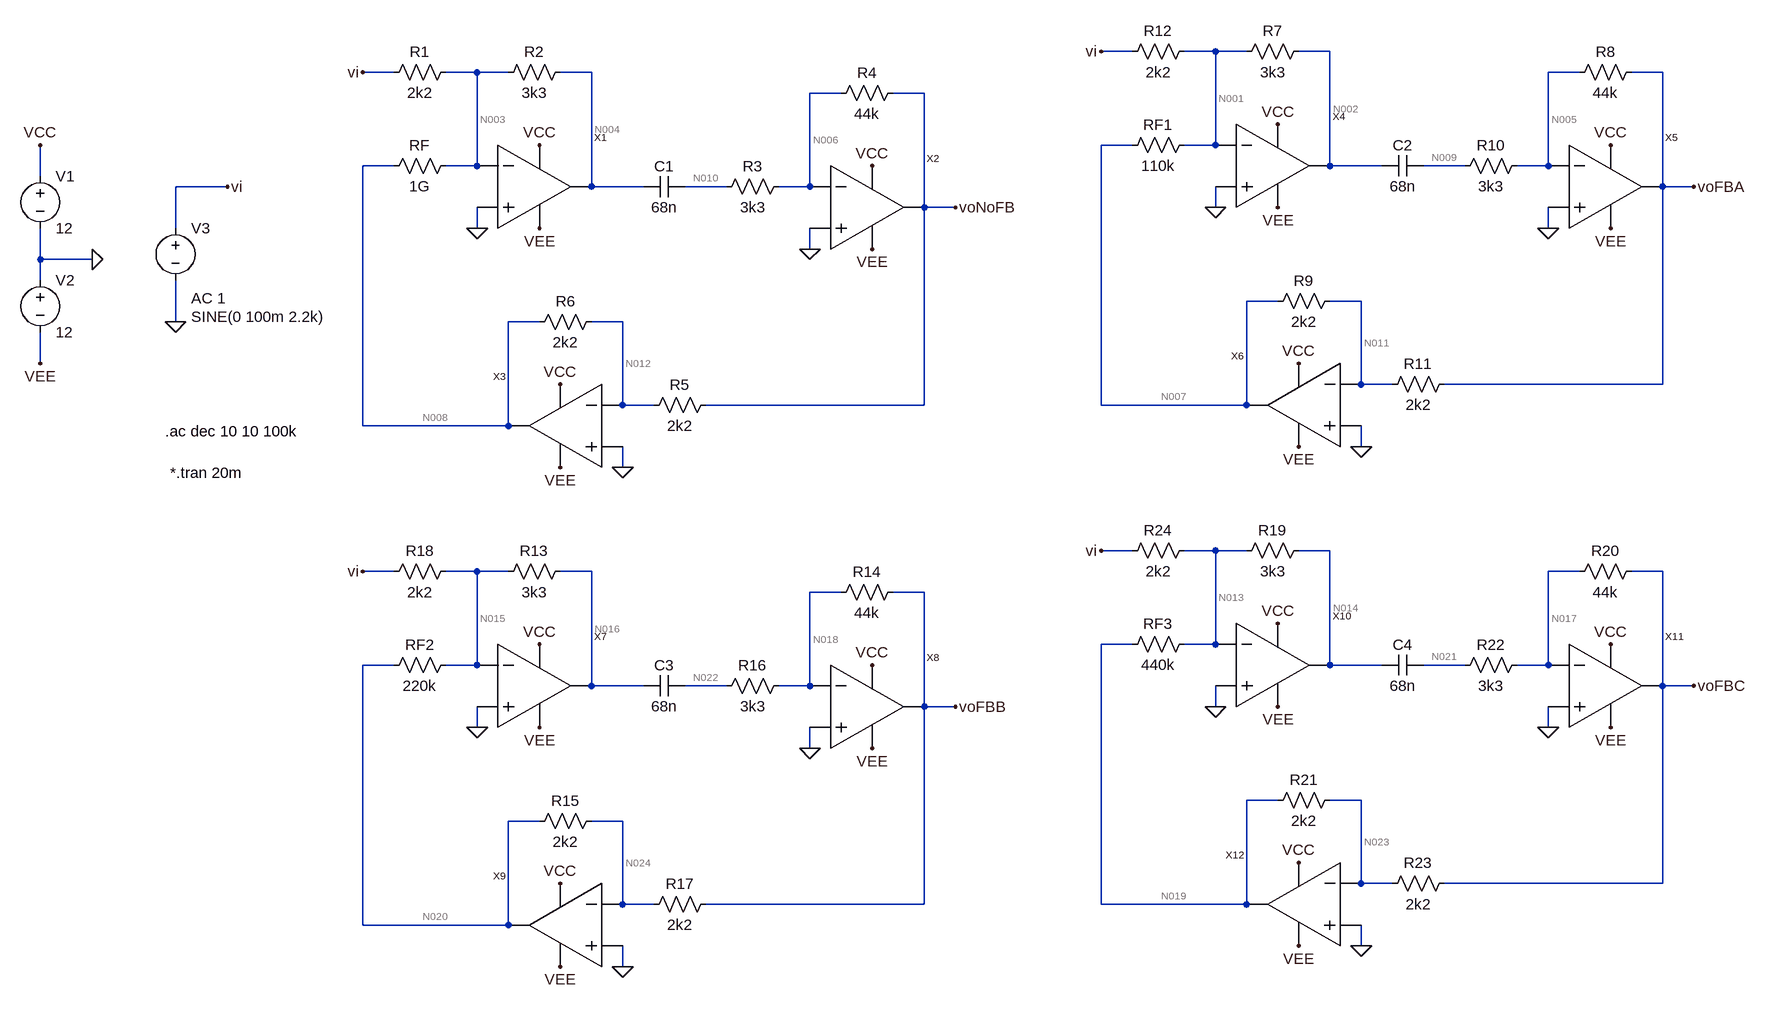
[diagram p0: schematic Perc-02-02-gabung.asc]
Perc-02-02-gabung.asc, the LTspice schematic file:
Version 4
SHEET 1 2652 1336
WIRE 1696 -160 1648 -160
WIRE 1824 -160 1776 -160
WIRE 1872 -160 1824 -160
WIRE 2000 -160 1952 -160
WIRE 560 -128 512 -128
WIRE 688 -128 640 -128
WIRE 736 -128 688 -128
WIRE 864 -128 816 -128
WIRE 2384 -128 2336 -128
WIRE 2512 -128 2464 -128
WIRE 1248 -96 1200 -96
WIRE 1376 -96 1328 -96
WIRE 1696 -16 1648 -16
WIRE 1824 -16 1824 -160
WIRE 1824 -16 1776 -16
WIRE 560 16 512 16
WIRE 688 16 688 -128
WIRE 688 16 640 16
WIRE 2000 16 2000 -160
WIRE 2080 16 2000 16
WIRE 2208 16 2144 16
WIRE 2336 16 2336 -128
WIRE 2336 16 2288 16
WIRE 16 32 16 -16
WIRE 304 48 224 48
WIRE 864 48 864 -128
WIRE 944 48 864 48
WIRE 1072 48 1008 48
WIRE 1200 48 1200 -96
WIRE 1200 48 1152 48
WIRE 2512 48 2512 -128
WIRE 2512 48 2496 48
WIRE 2560 48 2512 48
WIRE 1376 80 1376 -96
WIRE 1376 80 1360 80
WIRE 1424 80 1376 80
WIRE 1824 80 1824 48
WIRE 224 112 224 48
WIRE 688 112 688 80
WIRE 2336 112 2336 80
WIRE 1200 144 1200 112
WIRE 16 160 16 112
WIRE 96 160 16 160
WIRE 16 192 16 160
WIRE 1920 224 1872 224
WIRE 2048 224 2000 224
WIRE 224 256 224 192
WIRE 784 256 736 256
WIRE 912 256 864 256
WIRE 16 320 16 272
WIRE 2048 352 2048 224
WIRE 2096 352 2048 352
WIRE 2512 352 2512 48
WIRE 2512 352 2176 352
WIRE 912 384 912 256
WIRE 960 384 912 384
WIRE 1376 384 1376 80
WIRE 1376 384 1040 384
WIRE 1648 384 1648 -16
WIRE 1872 384 1872 224
WIRE 1872 384 1648 384
WIRE 512 416 512 16
WIRE 736 416 736 256
WIRE 736 416 512 416
WIRE 2048 448 2048 416
WIRE 912 480 912 448
WIRE 1696 608 1648 608
WIRE 1824 608 1776 608
WIRE 1872 608 1824 608
WIRE 2000 608 1952 608
WIRE 560 640 512 640
WIRE 688 640 640 640
WIRE 736 640 688 640
WIRE 864 640 816 640
WIRE 2384 640 2336 640
WIRE 2512 640 2464 640
WIRE 1248 672 1200 672
WIRE 1376 672 1328 672
WIRE 1696 752 1648 752
WIRE 1824 752 1824 608
WIRE 1824 752 1776 752
WIRE 560 784 512 784
WIRE 688 784 688 640
WIRE 688 784 640 784
WIRE 2000 784 2000 608
WIRE 2080 784 2000 784
WIRE 2208 784 2144 784
WIRE 2336 784 2336 640
WIRE 2336 784 2288 784
WIRE 864 816 864 640
WIRE 944 816 864 816
WIRE 1072 816 1008 816
WIRE 1200 816 1200 672
WIRE 1200 816 1152 816
WIRE 2512 816 2512 640
WIRE 2512 816 2496 816
WIRE 2560 816 2512 816
WIRE 1376 848 1376 672
WIRE 1376 848 1360 848
WIRE 1424 848 1376 848
WIRE 1824 848 1824 816
WIRE 688 880 688 848
WIRE 2336 880 2336 848
WIRE 1200 912 1200 880
WIRE 1920 992 1872 992
WIRE 2048 992 2000 992
WIRE 784 1024 736 1024
WIRE 912 1024 864 1024
WIRE 2048 1120 2048 992
WIRE 2096 1120 2048 1120
WIRE 2512 1120 2512 816
WIRE 2512 1120 2176 1120
WIRE 912 1152 912 1024
WIRE 960 1152 912 1152
WIRE 1376 1152 1376 848
WIRE 1376 1152 1040 1152
WIRE 1648 1152 1648 752
WIRE 1872 1152 1872 992
WIRE 1872 1152 1648 1152
WIRE 512 1184 512 784
WIRE 736 1184 736 1024
WIRE 736 1184 512 1184
WIRE 2048 1216 2048 1184
WIRE 912 1248 912 1216
FLAG 16 -16 VCC
FLAG 16 320 VEE
FLAG 96 160 0
FLAG 784 -16 VCC
FLAG 1296 16 VCC
FLAG 816 352 VCC
FLAG 816 480 VEE
FLAG 784 112 VEE
FLAG 1296 144 VEE
FLAG 688 112 0
FLAG 1200 144 0
FLAG 912 480 0
FLAG 1424 80 voNoFB
FLAG 512 -128 vi
FLAG 304 48 vi
FLAG 224 256 0
FLAG 1920 -48 VCC
FLAG 2432 -16 VCC
FLAG 1952 320 VCC
FLAG 1952 448 VEE
FLAG 1920 80 VEE
FLAG 2432 112 VEE
FLAG 1824 80 0
FLAG 2336 112 0
FLAG 2048 448 0
FLAG 2560 48 voFBA
FLAG 1648 -160 vi
FLAG 784 752 VCC
FLAG 1296 784 VCC
FLAG 816 1120 VCC
FLAG 816 1248 VEE
FLAG 784 880 VEE
FLAG 1296 912 VEE
FLAG 688 880 0
FLAG 1200 912 0
FLAG 912 1248 0
FLAG 1424 848 voFBB
FLAG 512 640 vi
FLAG 1920 720 VCC
FLAG 2432 752 VCC
FLAG 1952 1088 VCC
FLAG 1952 1216 VEE
FLAG 1920 848 VEE
FLAG 2432 880 VEE
FLAG 1824 848 0
FLAG 2336 880 0
FLAG 2048 1216 0
FLAG 2560 816 voFBC
FLAG 1648 608 vi
SYMBOL voltage 16 16 R0
SYMATTR InstName V1
SYMATTR Value 12
SYMBOL voltage 16 176 R0
SYMATTR InstName V2
SYMATTR Value 12
SYMBOL Opampku 768 48 R0
SYMATTR InstName X1
SYMBOL Opampku 1280 80 R0
SYMATTR InstName X2
SYMBOL Opampku 832 416 M0
SYMATTR InstName X3
SYMBOL res 832 -144 R90
WINDOW 0 0 56 VBottom 2
WINDOW 3 32 56 VTop 2
SYMATTR InstName R2
SYMATTR Value 3k3
SYMBOL res 1344 -112 R90
WINDOW 0 0 56 VBottom 2
WINDOW 3 32 56 VTop 2
SYMATTR InstName R4
SYMATTR Value 44k
SYMBOL res 880 240 R90
WINDOW 0 0 56 VBottom 2
WINDOW 3 32 56 VTop 2
SYMATTR InstName R6
SYMATTR Value 2k2
SYMBOL res 656 0 R90
WINDOW 0 0 56 VBottom 2
WINDOW 3 32 56 VTop 2
SYMATTR InstName RF
SYMATTR Value 1G
SYMBOL res 1168 32 R90
WINDOW 0 0 56 VBottom 2
WINDOW 3 32 56 VTop 2
SYMATTR InstName R3
SYMATTR Value 3k3
SYMBOL res 1056 368 R90
WINDOW 0 0 56 VBottom 2
WINDOW 3 32 56 VTop 2
SYMATTR InstName R5
SYMATTR Value 2k2
SYMBOL res 656 -144 R90
WINDOW 0 0 56 VBottom 2
WINDOW 3 32 56 VTop 2
SYMATTR InstName R1
SYMATTR Value 2k2
SYMBOL voltage 224 96 R0
WINDOW 3 24 152 Left 2
WINDOW 123 24 124 Left 2
WINDOW 39 0 0 Left 0
SYMATTR Value SINE(0 100m 2.2k)
SYMATTR Value2 AC 1
SYMATTR InstName V3
SYMBOL cap 1008 32 R90
WINDOW 0 0 32 VBottom 2
WINDOW 3 32 32 VTop 2
SYMATTR InstName C1
SYMATTR Value 68n
SYMBOL Opampku 1904 16 R0
SYMATTR InstName X4
SYMBOL Opampku 2416 48 R0
SYMATTR InstName X5
SYMBOL Opampku 1968 384 M0
SYMATTR InstName X6
SYMBOL res 1968 -176 R90
WINDOW 0 0 56 VBottom 2
WINDOW 3 32 56 VTop 2
SYMATTR InstName R7
SYMATTR Value 3k3
SYMBOL res 2480 -144 R90
WINDOW 0 0 56 VBottom 2
WINDOW 3 32 56 VTop 2
SYMATTR InstName R8
SYMATTR Value 44k
SYMBOL res 2016 208 R90
WINDOW 0 0 56 VBottom 2
WINDOW 3 32 56 VTop 2
SYMATTR InstName R9
SYMATTR Value 2k2
SYMBOL res 1792 -32 R90
WINDOW 0 0 56 VBottom 2
WINDOW 3 32 56 VTop 2
SYMATTR InstName RF1
SYMATTR Value 110k
SYMBOL res 2304 0 R90
WINDOW 0 0 56 VBottom 2
WINDOW 3 32 56 VTop 2
SYMATTR InstName R10
SYMATTR Value 3k3
SYMBOL res 2192 336 R90
WINDOW 0 0 56 VBottom 2
WINDOW 3 32 56 VTop 2
SYMATTR InstName R11
SYMATTR Value 2k2
SYMBOL res 1792 -176 R90
WINDOW 0 0 56 VBottom 2
WINDOW 3 32 56 VTop 2
SYMATTR InstName R12
SYMATTR Value 2k2
SYMBOL cap 2144 0 R90
WINDOW 0 0 32 VBottom 2
WINDOW 3 32 32 VTop 2
SYMATTR InstName C2
SYMATTR Value 68n
SYMBOL Opampku 768 816 R0
SYMATTR InstName X7
SYMBOL Opampku 1280 848 R0
SYMATTR InstName X8
SYMBOL Opampku 832 1184 M0
SYMATTR InstName X9
SYMBOL res 832 624 R90
WINDOW 0 0 56 VBottom 2
WINDOW 3 32 56 VTop 2
SYMATTR InstName R13
SYMATTR Value 3k3
SYMBOL res 1344 656 R90
WINDOW 0 0 56 VBottom 2
WINDOW 3 32 56 VTop 2
SYMATTR InstName R14
SYMATTR Value 44k
SYMBOL res 880 1008 R90
WINDOW 0 0 56 VBottom 2
WINDOW 3 32 56 VTop 2
SYMATTR InstName R15
SYMATTR Value 2k2
SYMBOL res 656 768 R90
WINDOW 0 0 56 VBottom 2
WINDOW 3 32 56 VTop 2
SYMATTR InstName RF2
SYMATTR Value 220k
SYMBOL res 1168 800 R90
WINDOW 0 0 56 VBottom 2
WINDOW 3 32 56 VTop 2
SYMATTR InstName R16
SYMATTR Value 3k3
SYMBOL res 1056 1136 R90
WINDOW 0 0 56 VBottom 2
WINDOW 3 32 56 VTop 2
SYMATTR InstName R17
SYMATTR Value 2k2
SYMBOL res 656 624 R90
WINDOW 0 0 56 VBottom 2
WINDOW 3 32 56 VTop 2
SYMATTR InstName R18
SYMATTR Value 2k2
SYMBOL cap 1008 800 R90
WINDOW 0 0 32 VBottom 2
WINDOW 3 32 32 VTop 2
SYMATTR InstName C3
SYMATTR Value 68n
SYMBOL Opampku 1904 784 R0
SYMATTR InstName X10
SYMBOL Opampku 2416 816 R0
SYMATTR InstName X11
SYMBOL Opampku 1968 1152 M0
SYMATTR InstName X12
SYMBOL res 1968 592 R90
WINDOW 0 0 56 VBottom 2
WINDOW 3 32 56 VTop 2
SYMATTR InstName R19
SYMATTR Value 3k3
SYMBOL res 2480 624 R90
WINDOW 0 0 56 VBottom 2
WINDOW 3 32 56 VTop 2
SYMATTR InstName R20
SYMATTR Value 44k
SYMBOL res 2016 976 R90
WINDOW 0 0 56 VBottom 2
WINDOW 3 32 56 VTop 2
SYMATTR InstName R21
SYMATTR Value 2k2
SYMBOL res 1792 736 R90
WINDOW 0 0 56 VBottom 2
WINDOW 3 32 56 VTop 2
SYMATTR InstName RF3
SYMATTR Value 440k
SYMBOL res 2304 768 R90
WINDOW 0 0 56 VBottom 2
WINDOW 3 32 56 VTop 2
SYMATTR InstName R22
SYMATTR Value 3k3
SYMBOL res 2192 1104 R90
WINDOW 0 0 56 VBottom 2
WINDOW 3 32 56 VTop 2
SYMATTR InstName R23
SYMATTR Value 2k2
SYMBOL res 1792 592 R90
WINDOW 0 0 56 VBottom 2
WINDOW 3 32 56 VTop 2
SYMATTR InstName R24
SYMATTR Value 2k2
SYMBOL cap 2144 768 R90
WINDOW 0 0 32 VBottom 2
WINDOW 3 32 32 VTop 2
SYMATTR InstName C4
SYMATTR Value 68n
TEXT 208 424 Left 2 !.ac dec 10 10 100k
TEXT 216 488 Left 2 !*.tran 20m

The netlist it stands for:
* Perc-02-02-gabung.asc
V1 VCC 0 12
V2 0 VEE 12
XX1 N003 0 VCC VEE N004 Opampku  ; pins inn inp vp vn out
XX2 N006 0 VCC VEE voNoFB Opampku  ; pins inn inp vp vn out
XX3 N012 0 VCC VEE N008 Opampku  ; pins inn inp vp vn out
R2 N004 N003 3k3
R4 voNoFB N006 44k
R6 N012 N008 2k2
RF N003 N008 1G
R3 N006 N010 3k3
R5 voNoFB N012 2k2
R1 N003 vi 2k2
V3 vi 0 SINE(0 100m 2.2k) AC 1
C1 N010 N004 68n
XX4 N001 0 VCC VEE N002 Opampku  ; pins inn inp vp vn out
XX5 N005 0 VCC VEE voFBA Opampku  ; pins inn inp vp vn out
XX6 N011 0 VCC VEE N007 Opampku  ; pins inn inp vp vn out
R7 N002 N001 3k3
R8 voFBA N005 44k
R9 N011 N007 2k2
RF1 N001 N007 110k
R10 N005 N009 3k3
R11 voFBA N011 2k2
R12 N001 vi 2k2
C2 N009 N002 68n
XX7 N015 0 VCC VEE N016 Opampku  ; pins inn inp vp vn out
XX8 N018 0 VCC VEE voFBB Opampku  ; pins inn inp vp vn out
XX9 N024 0 VCC VEE N020 Opampku  ; pins inn inp vp vn out
R13 N016 N015 3k3
R14 voFBB N018 44k
R15 N024 N020 2k2
RF2 N015 N020 220k
R16 N018 N022 3k3
R17 voFBB N024 2k2
R18 N015 vi 2k2
C3 N022 N016 68n
XX10 N013 0 VCC VEE N014 Opampku  ; pins inn inp vp vn out
XX11 N017 0 VCC VEE voFBC Opampku  ; pins inn inp vp vn out
XX12 N023 0 VCC VEE N019 Opampku  ; pins inn inp vp vn out
R19 N014 N013 3k3
R20 voFBC N017 44k
R21 N023 N019 2k2
RF3 N013 N019 440k
R22 N017 N021 3k3
R23 voFBC N023 2k2
R24 N013 vi 2k2
C4 N021 N014 68n
.ac dec 10 10 100k
*.tran 20m
.backanno
.end

* Results of the author's LTspice run, read from the files saved beside the schematic
* Operating Point, zero values left out:
*   V(vcc) = 12 V
*   V(vee) = -12 V
*   V(n004) = 311.4 µV
*   V(n003) = 19.25 µV
*   V(vonofb) = 3.529 mV
*   V(n006) = 19.23 µV
*   V(n008) = -3.315 mV
*   V(n012) = 19.27 µV
*   V(n010) = 19.23 µV
*   V(n002) = 411.4 µV
*   V(n001) = 19.25 µV
*   V(vofba) = 3.529 mV
*   V(n005) = 19.23 µV
*   V(n007) = -3.315 mV
*   V(n011) = 19.27 µV
*   V(n009) = 19.23 µV
*   V(n016) = 361.4 µV
*   V(n015) = 19.25 µV
*   V(vofbb) = 3.529 mV
*   V(n018) = 19.23 µV
*   V(n020) = -3.315 mV
*   V(n024) = 19.27 µV
*   V(n022) = 19.23 µV
*   V(n014) = 336.4 µV
*   V(n013) = 19.25 µV
*   V(vofbc) = 3.529 mV
*   V(n017) = 19.23 µV
*   V(n019) = -3.315 mV
*   V(n023) = 19.27 µV
*   V(n021) = 19.23 µV
*   I(R24) = 8.75 nA
*   I(R23) = 1.595 µA
*   I(Rf3) = 7.578 nA
*   I(R21) = 1.516 µA
*   I(R20) = 79.76 nA
*   I(R19) = 96.09 nA
*   I(R18) = 8.75 nA
*   I(R17) = 1.595 µA
*   I(Rf2) = 15.16 nA
*   I(R15) = 1.516 µA
*   I(R14) = 79.76 nA
*   I(R13) = 103.7 nA
*   I(R12) = 8.75 nA
*   I(R11) = 1.595 µA
*   I(Rf1) = 30.31 nA
*   I(R9) = 1.516 µA
*   I(R8) = 79.76 nA
*   I(R7) = 118.8 nA
*   I(R1) = 8.75 nA
*   I(R5) = 1.595 µA
*   I(Rf) = 3.334 pA
*   I(R6) = 1.516 µA
*   I(R4) = 79.76 nA
*   I(R2) = 88.52 nA
*   I(V3) = 35 nA
*   I(V2) = -16.04 mA
*   I(V1) = -16.04 mA
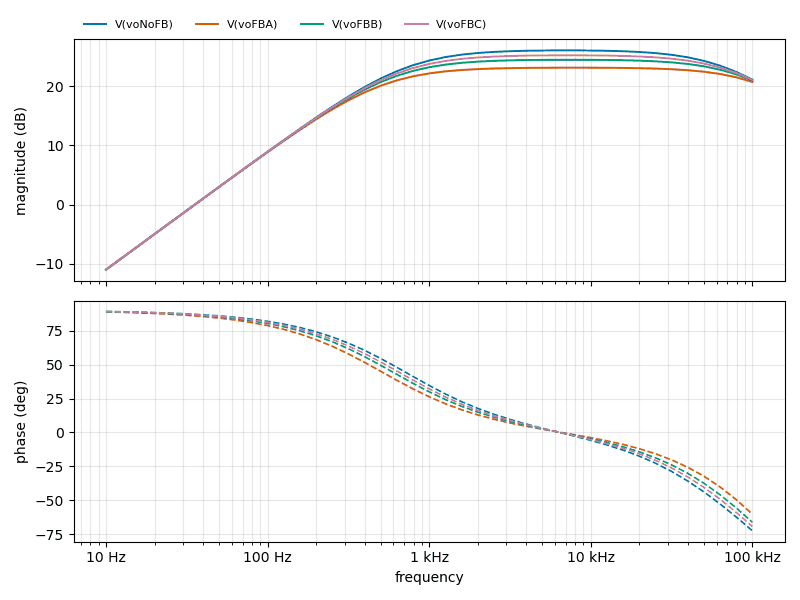
[diagram p1: AC Analysis of Perc-02-02-gabung.asc, plotted from the saved traces]
* AC Analysis, 1 run:
*   V(voNoFB): -11.00 dB at 10 Hz, 21.09 dB at 100 kHz, peak 26.01 dB at 6.31 kHz, 3 dB below the peak at 706 Hz and 69.42 kHz
*   V(voFBA): -11.00 dB at 10 Hz, 20.69 dB at 100 kHz, peak 23.10 dB at 7.943 kHz, 3 dB below the peak at 504.8 Hz
*   V(voFBB): -11.00 dB at 10 Hz, 20.94 dB at 100 kHz, peak 24.43 dB at 7.943 kHz, 3 dB below the peak at 590.2 Hz and 89.78 kHz
*   V(voFBC): -11.00 dB at 10 Hz, 21.02 dB at 100 kHz, peak 25.19 dB at 7.943 kHz, 3 dB below the peak at 640.2 Hz and 79.69 kHz